# EAGLE design v8_engine (EAGLE 8.3.2)
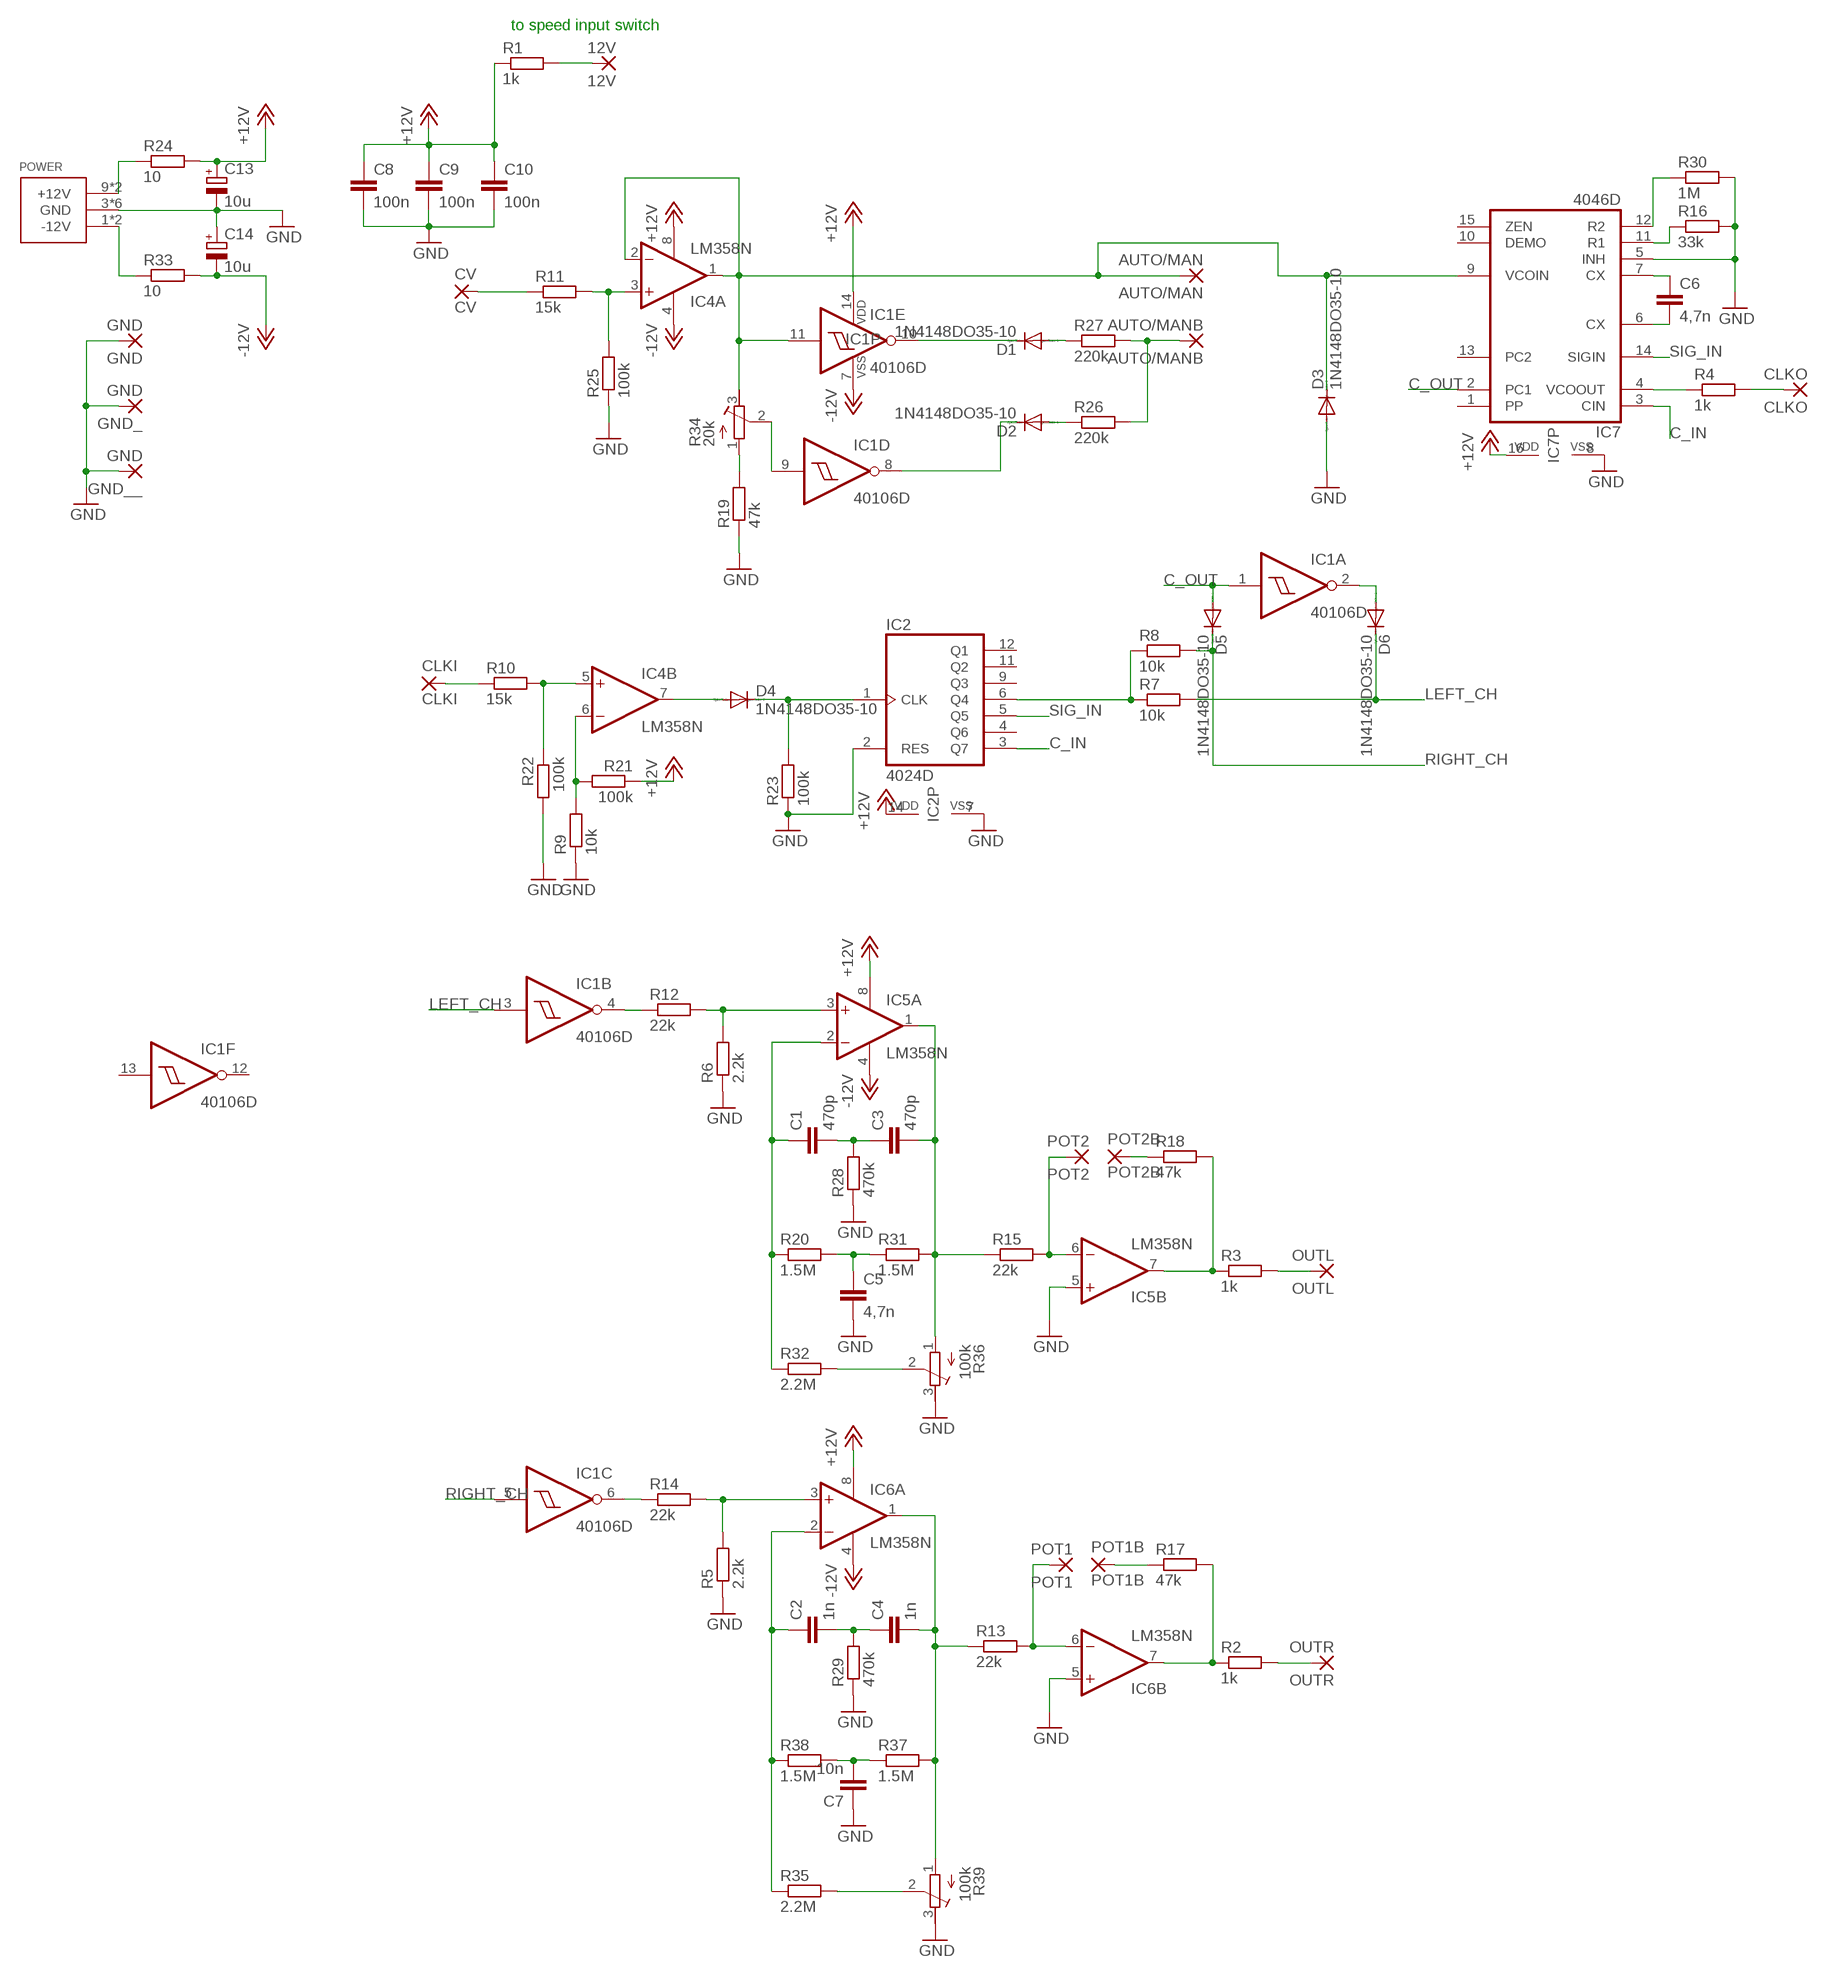
[diagram p0: schematic, sheet 1]

## Parts
12V  12V  1,6/0,9  [1,6/0,9]
AUTO/MAN  AUTO/MAN  1,6/0,9  [1,6/0,9]
AUTO/MANB  AUTO/MANB  1,6/0,9  [1,6/0,9]
C1  470p  C-EU050-025X075  [C050-025X075]
C2  1n  C-EU050-025X075  [C050-025X075]
C3  470p  C-EU050-025X075  [C050-025X075]
C4  1n  C-EU050-025X075  [C050-025X075]
C5  4,7n  C-EU050-025X075  [C050-025X075]
C6  4,7n  C-EU050-025X075  [C050-025X075]
C7  10n  C-EU050-025X075  [C050-025X075]
C8  100n  C-EU050-025X075  [C050-025X075]
C9  100n  C-EU050-025X075  [C050-025X075]
C10  100n  C-EU050-025X075  [C050-025X075]
C13  10u  CPOL-EUE2.5-6  [E2,5-6]
C14  10u  CPOL-EUE2.5-6  [E2,5-6]
CLKI  CLKI  1,6/0,9  [1,6/0,9]
CLKO  CLKO  1,6/0,9  [1,6/0,9]
CV  CV  1,6/0,9  [1,6/0,9]
D1  1N4148DO35-10  [DO35-10]
D2  1N4148DO35-10  [DO35-10]
D3  1N4148DO35-10  [DO35-10]
D4  1N4148DO35-10  [DO35-10]
D5  1N4148DO35-10  [DO35-10]
D6  1N4148DO35-10  [DO35-10]
GND  GND  1,6/0,9  [1,6/0,9]
GND_  GND  1,6/0,9  [1,6/0,9]
GND__  GND  1,6/0,9  [1,6/0,9]
IC1  40106D  [SO14]
IC2  4024D  [SO14]
IC4  LM358N  [DIL08]
IC5  LM358N  [DIL08]
IC6  LM358N  [DIL08]
IC7  4046D  [SO16]
OUTL  OUTL  1,6/0,9  [1,6/0,9]
OUTR  OUTR  1,6/0,9  [1,6/0,9]
POT1  POT1  1,6/0,9  [1,6/0,9]
POT1B  POT1B  1,6/0,9  [1,6/0,9]
POT2  POT2  1,6/0,9  [1,6/0,9]
POT2B  POT2B  1,6/0,9  [1,6/0,9]
POWER  POWER_SIMPLE10  [POWER_10]
R1  1k  R-EU_0207/10  [0207/10]
R2  1k  R-EU_0207/10  [0207/10]
R3  1k  R-EU_0207/10  [0207/10]
R4  1k  R-EU_0207/10  [0207/10]
R5  2.2k  R-EU_0207/10  [0207/10]
R6  2.2k  R-EU_0207/10  [0207/10]
R7  10k  R-EU_0207/10  [0207/10]
R8  10k  R-EU_0207/10  [0207/10]
R9  10k  R-EU_0207/10  [0207/10]
R10  15k  R-EU_0207/10  [0207/10]
R11  15k  R-EU_0207/10  [0207/10]
R12  22k  R-EU_0207/10  [0207/10]
R13  22k  R-EU_0207/10  [0207/10]
R14  22k  R-EU_0207/10  [0207/10]
R15  22k  R-EU_0207/10  [0207/10]
R16  33k  R-EU_0207/10  [0207/10]
R17  47k  R-EU_0207/10  [0207/10]
R18  47k  R-EU_0207/10  [0207/10]
R19  47k  R-EU_0207/10  [0207/10]
R20  1.5M  R-EU_0207/10  [0207/10]
R21  100k  R-EU_0207/10  [0207/10]
R22  100k  R-EU_0207/10  [0207/10]
R23  100k  R-EU_0207/10  [0207/10]
R24  10  R-EU_0207/10  [0207/10]
R25  100k  R-EU_0207/10  [0207/10]
R26  220k  R-EU_0207/10  [0207/10]
R27  220k  R-EU_0207/10  [0207/10]
R28  470k  R-EU_0207/10  [0207/10]
R29  470k  R-EU_0207/10  [0207/10]
R30  1M  R-EU_0207/10  [0207/10]
R31  1.5M  R-EU_0207/10  [0207/10]
R32  2.2M  R-EU_0207/10  [0207/10]
R33  10  R-EU_0207/10  [0207/10]
R34  20k  R-TRIMM3339P  [RTRIM3339P]
R35  2.2M  R-EU_0207/10  [0207/10]
R36  100k  R-TRIMM3339P  [RTRIM3339P]
R37  1.5M  R-EU_0207/10  [0207/10]
R38  1.5M  R-EU_0207/10  [0207/10]
R39  100k  R-TRIMM3339P  [RTRIM3339P]

## Nets
+12V: C8.1 C9.1 C10.1 C13.+ IC1.14(P:VDD) IC2.14(VDD) IC4.8(P:V+) IC5.8(P:V+) IC6.8(P:V+) IC7.16(VDD) R1.1 R21.1 R24.2
-12V: C14.- IC1.7(P:VSS) IC4.4(P:V-) IC5.4(P:V-) IC6.4(P:V-) R33.2
C_IN: IC2.3(Q7) IC7.3(CIN)
C_OUT: D5.A IC1.1(A:I) IC7.2(PC1)
CLKO: CLKO.1(P) R4.2
GND: C5.2 C7.1 C8.2 C9.2 C10.2 C13.- C14.+ D3.A GND.1(P) GND_.1(P) GND__.1(P) IC2.2(RES) IC2.7(VSS) IC5.5(B:+IN) IC6.5(B:+IN) IC7.5(INH) IC7.8(VSS) POWER.3(GND) POWER.4(GND) POWER.5(GND) POWER.6(GND) POWER.7(GND) POWER.8(GND) R5.1 R6.1 R9.1 R16.2 R19.1 R22.2 R23.1 R25.1 R28.1 R29.1 R30.2 R36.3(E) R39.3(E)
LEFT_CH: D6.C IC1.3(B:I) R7.2
N$1: IC7.4(VCOOUT) R4.1
N$2: D1.A R27.1
N$3: POWER.9(+12V) POWER.10(+12V) R24.1
N$4: POWER.1(-12V) POWER.2(-12V) R33.1
N$5: AUTO/MANB.1(P) R26.2 R27.2
N$6: D2.C IC1.8(D:O)
N$7: D2.A R26.1
N$8: D1.C IC1.10(E:O)
N$10: IC1.9(D:I) R34.2(S)
N$11: CLKI.1(P) R10.1
N$12: R19.2 R34.1(A)
N$13: CV.1(P) R11.1
N$14: IC4.3(A:+IN) R11.2 R25.2
N$15: IC4.5(B:+IN) R10.2 R22.1
N$16: C6.1 IC7.7(CX)
N$17: C6.2 IC7.6(CX)
N$18: IC7.11(R1) R16.1
N$19: IC7.12(R2) R30.1
N$20: D4.A IC4.7(B:OUT)
N$21: D4.C IC2.1(CLK) R23.2
N$22: IC2.6(Q4) R7.1 R8.1
N$23: IC4.6(B:-IN) R9.2 R21.2
N$24: IC1.4(B:O) R12.1
N$25: IC5.3(A:+IN) R6.2 R12.2
N$26: D6.A IC1.2(A:O)
N$27: C1.1 IC5.2(A:-IN) R20.1 R32.1
N$28: R32.2 R36.2(S)
N$29: C3.2 IC5.1(A:OUT) R15.1 R31.2 R36.1(A)
N$30: C5.1 R20.2 R31.1
N$31: C1.2 C3.1 R28.2
N$32: IC5.6(B:-IN) POT2.1(P) R15.2
N$33: IC5.7(B:OUT) R3.1 R18.2
N$34: POT2B.1(P) R18.1
N$35: OUTL.1(P) R3.2
N$36: C2.2 C4.1 R29.2
N$37: C2.1 IC6.2(A:-IN) R35.1 R38.1
N$38: C4.2 IC6.1(A:OUT) R13.1 R37.2 R39.1(A)
N$39: C7.2 R37.1 R38.2
N$40: 12V.1(P) R1.2
N$41: IC1.6(C:O) R14.1
N$42: IC6.3(A:+IN) R5.2 R14.2
N$43: IC6.6(B:-IN) POT1.1(P) R13.2
N$44: OUTR.1(P) R2.2
N$45: POT1B.1(P) R17.1
N$46: IC6.7(B:OUT) R2.1 R17.2
N$47: R35.2 R39.2(S)
N$48: AUTO/MAN.1(P) D3.C IC1.11(E:I) IC4.1(A:OUT) IC4.2(A:-IN) IC7.9(VCOIN) R34.3(E)
RIGHT_CH: D5.C IC1.5(C:I) R8.2
SIG_IN: IC2.5(Q5) IC7.14(SIGIN)
Unconnected: IC1.12(F:O) IC1.13(F:I) IC2.4(Q6) IC2.9(Q3) IC2.11(Q2) IC2.12(Q1) IC7.1(PP) IC7.10(DEMO) IC7.13(PC2) IC7.15(ZEN)

## Notes on the sheet
- to speed input switch

## Library data of the parts
12V AUTO/MAN AUTO/MANB CLKI CLKO CV GND GND_ GND__ OUTL OUTR POT1 POT1B POT2 POT2B = wirepad:1,6/0,9: THROUGH-HOLE PAD
C1-C10 = rcl:C-EU: CAPACITOR, European symbol
C13 C14 = rcl:CPOL-EU: POLARIZED CAPACITOR, European symbol
D1-D6 = diode:1N4148: DIODE high speed (Philips)
IC1 = 40xx:40106: Hex SCHMITT TRIGGER
IC2 = 40xx:4024: 7-stage binary/ripple COUNTER
IC4-IC6 = linear:LM358: OP AMP also LM158; LM258; LM2904 Source: http://cache.national.com/ds/LM/LM158.pdf
IC7 = 40xx:4046: Micropower PLL
POWER = eurorack:POWER_SIMPLE
R1-R33 R35 R37 R38 = resistor:R-EU_: RESISTOR, European symbol
R34 R36 R39 = rcl:R-TRIMM: Trimm resistor

## Board
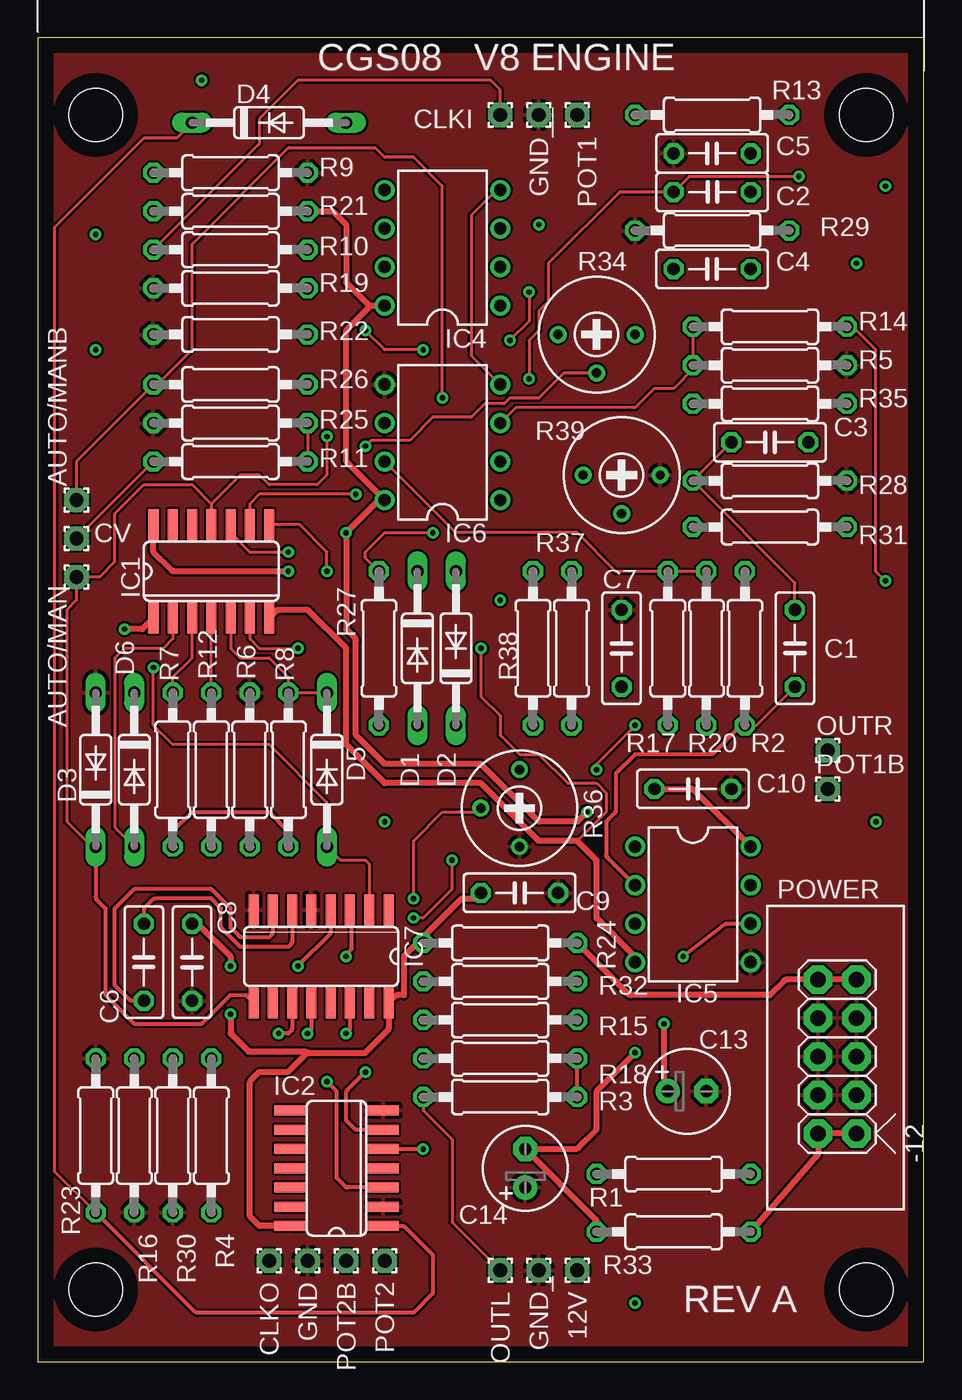
[diagram p1: board, top side]
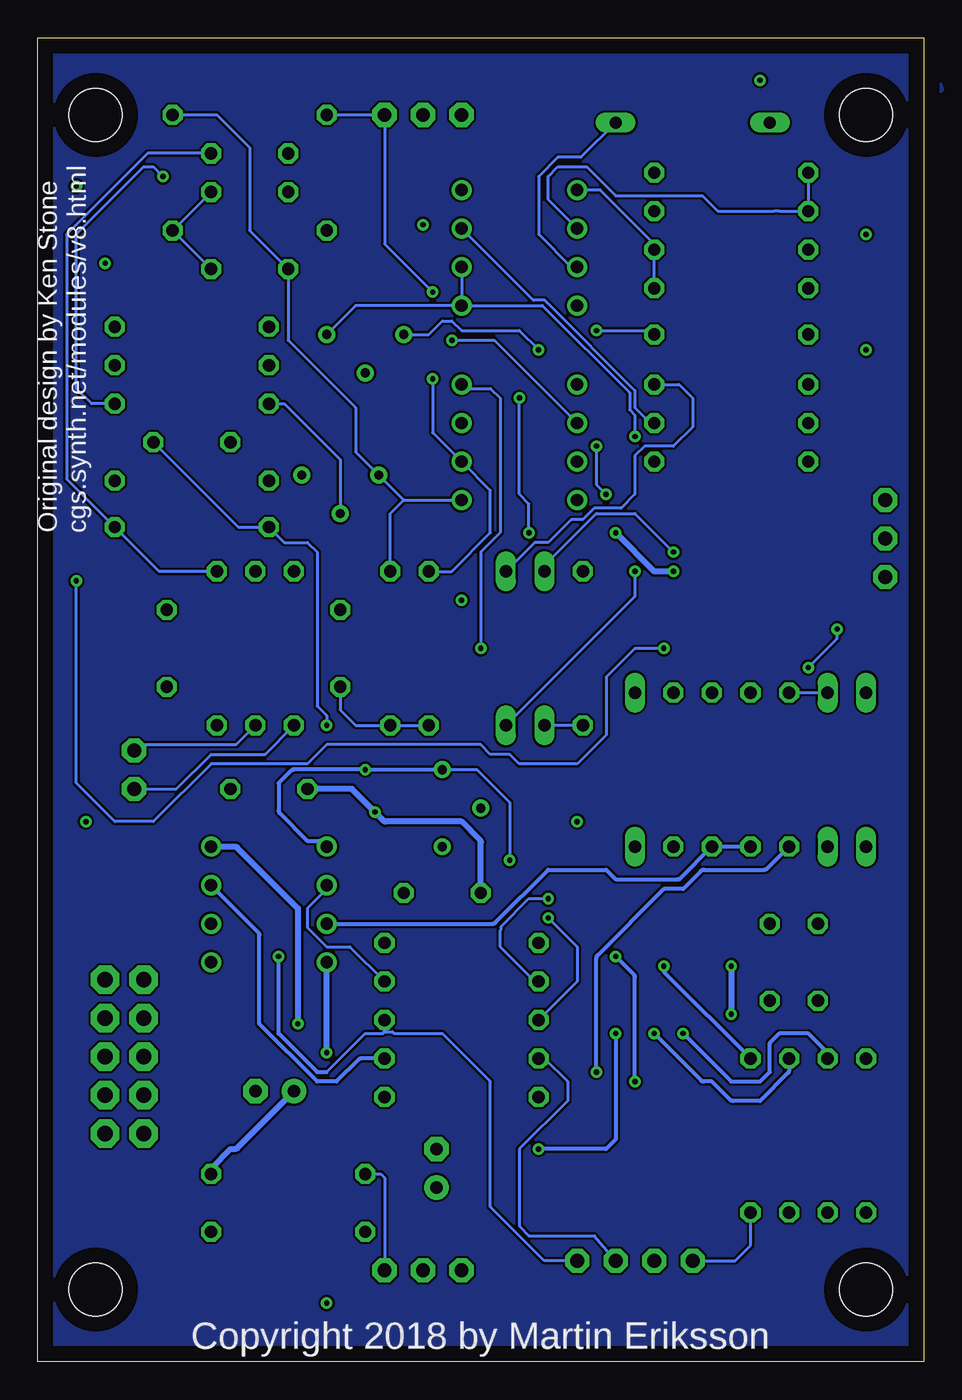
[diagram p2: board, bottom side, seen from below]

Size 58.41 x 87.3 mm. Coordinates in mm from the lower left corner, seen from the top.
Outline: 0,87.3 0,0 58.41,0 58.41,87.3 0,87.3
Copper layers (1*16): Top 0.035mm / dielectric 1.5mm / Bottom 0.035mm
Design rules "default": minimum track width 6mil, minimum drill 0.35mm, track to track 6mil, track to pad 6mil, pad to pad 6mil, via to via 6mil, smd to smd 6mil, copper to edge 40mil, drill to drill 6mil, minimum pad ring 10mil, minimum via ring 8mil, stop-mask expansion 4mil, vias tented up to drill 0mil, thermal gap 10mil
Holes 3.5 mm at 54.61,82.22 54.61,4.75 3.81,82.22 3.81,4.75

### Footprints (pad centres in the part's own frame; a part is rotated, then mirrored left to right if it is on the bottom)
1,6/0,9 = drill 0.914 pad 1.6 octagon: 1 0,0
C050-025X075 = drill 0.813 octagon: 1 -2.54,0; 2 2.54,0
E2,5-6 = drill 0.813 pad 1.6: + -1.27,0 | drill 0.813 pad 1.6 octagon: - 1.27,0
DO35-10 = drill 0.813 long: A 5.08,0; C -5.08,0
SO14 = smd 0.66 x 2.032: 1 -3.81,-3.073; 2 -2.54,-3.073; 3 -1.27,-3.073; 4 0,-3.073; 5 1.27,-3.073; 6 2.54,-3.073; 7 3.81,-3.073; 8 3.81,3.073; 9 2.54,3.073; 10 1.27,3.073; 11 0,3.073; 12 -1.27,3.073; 13 -2.54,3.073; 14 -3.81,3.073
DIL08 = drill 0.813 pad 1.27: 1 -3.81,-3.81; 2 -1.27,-3.81; 3 1.27,-3.81; 4 3.81,-3.81; 5 3.81,3.81; 6 1.27,3.81; 7 -1.27,3.81; 8 -3.81,3.81
SO16 = smd 0.66 x 2.032: 1 -4.445,-3.073; 2 -3.175,-3.073; 3 -1.905,-3.073; 4 -0.635,-3.073; 5 0.635,-3.073; 6 1.905,-3.073; 7 3.175,-3.073; 8 4.445,-3.073; 9 4.445,3.073; 10 3.175,3.073; 11 1.905,3.073; 12 0.635,3.073; 13 -0.635,3.073; 14 -1.905,3.073; 15 -3.175,3.073; 16 -4.445,3.073
POWER_10 = drill 1.016 pad 1.88 octagon: 1 -5.08,-1.27; 2 -5.08,1.27; 3 -2.54,-1.27; 4 -2.54,1.27; 5 0,-1.27; 6 0,1.27; 7 2.54,-1.27; 8 2.54,1.27; 9 5.08,-1.27; 10 5.08,1.27
0207/10 = drill 0.813 octagon: 1 -5.08,0; 2 5.08,0
RTRIM3339P = drill 0.61: 1 -2.54,0; 2 0,-2.54; 3 2.54,0

### Placement (x,y rotation side)
12V  35.56,6.02 0 top
AUTO/MAN  2.54,51.74 0 top
AUTO/MANB  2.54,56.82 0 top
C1  49.91,47.04 90 top
C2  44.45,77.14 0 top
C3  48.26,60.63 0 top
C4  44.45,72.06 180 top
C5  44.45,79.68 180 top
C6  6.99,26.34 90 top
C7  38.48,47.04 270 top
C8  10.16,26.34 270 top
C9  31.75,30.91 0 top
C10  43.18,37.77 0 top
C13  42.8,17.83 0 top
C14  32.13,12.75 90 top
CLKI  30.48,82.22 0 top
CLKO  15.24,6.66 0 top
CV  2.54,54.28 0 top
D1  25.02,47.04 270 top
D2  27.56,47.04 90 top
D3  3.81,39.04 90 top
D4  15.24,81.71 0 top
D5  19.05,39.04 270 top
D6  6.35,39.04 270 top
GND  17.78,6.66 0 top
GND_  33.02,6.02 0 top
GND__  33.02,82.22 0 top
IC1  11.43,52.12 0 top
IC2  19.68,12.75 90 top
IC4  26.67,73.46 90 top
IC5  43.18,30.15 270 top
IC6  26.67,60.63 90 top
IC7  18.67,26.72 180 top
OUTL  30.48,6.02 0 top
OUTR  52.07,40.31 0 top
POT1  35.56,82.22 0 top
POT1B  52.07,37.77 0 top
POT2  22.86,6.66 0 top
POT2B  20.32,6.66 0 top
POWER  52.7,20.12 90 top
R1  41.91,12.37 180 top
R2  44.07,47.04 270 top
R3  30.48,17.45 180 top
R4  11.43,14.91 270 top
R5  48.26,65.71 180 top
R6  13.97,39.04 270 top
R7  8.89,39.04 90 top
R8  16.51,39.04 90 top
R9  12.7,78.41 180 top
R10  12.7,73.33 0 top
R11  12.7,59.36 0 top
R12  11.43,39.04 270 top
R13  44.45,82.22 180 top
R14  48.26,68.25 180 top
R15  30.48,22.53 0 top
R16  6.35,14.91 270 top
R17  41.53,47.04 90 top
R18  30.48,19.99 0 top
R19  12.7,67.74 0 top
R20  46.61,47.04 90 top
R21  12.7,75.87 180 top
R22  12.7,70.79 180 top
R23  3.81,14.91 270 top
R24  30.48,27.61 180 top
R25  12.7,61.9 0 top
R26  12.7,64.44 180 top
R27  22.48,47.04 90 top
R28  48.26,58.09 180 top
R29  44.45,74.6 0 top
R30  8.89,14.91 270 top
R31  48.26,55.04 180 top
R32  30.48,25.07 180 top
R33  41.91,8.56 180 top
R34  36.83,67.74 0 top
R35  48.26,63.17 180 top
R36  31.75,36.5 270 top
R37  35.18,47.04 90 top
R38  32.64,47.04 270 top
R39  38.48,58.47 0 top

### Tracks (layer width: path | path; a pad name or v marks a point on that pad's centre or on a via)
+12V  (via drill 0.35)
  Top 0.406: 17.71,20.3 arc-45 17.89,20.37 | C8.1 10.44,28.88 arc-45 10.62,28.81 12.7,26.72 v12.7,26.09 | C9.1 28.9,30.6 arc-45 28.72,30.53 27.94,30.53 25.47,28.06 arc45 25.4,27.89 R24.2 25.12,27.61 arc45 24.95,27.54 24.13,26.72 24.13,24.18 23.75,24.18 arc45 23.57,24.11 IC7.16 23.11,22 arc-45 23.04,21.82 21.59,20.37 17.78,20.37 | v36.2,36.25 35.56,35.61 33.02,35.61 29.21,39.42 22.86,39.42 20.95,41.33 20.95,47.57 arc45 20.88,47.75 20.32,48.31 v20.32,54.66 22.41,56.75 arc-45 22.58,56.82 IC6.8 20.39,59.29 arc-45 20.32,59.47 20.32,67.91 arc-45 20.39,68.09 21.95,69.65 | v16.51,52.12 8.99,52.12 arc-45 8.82,52.2 7.62,53.39 IC1.14 | 21.95,69.65 IC4.8 | 21.95,69.65 arc-45 21.77,69.72 20.32,71.17 20.32,74.98 19.5,75.8 arc45 19.33,75.87 R21.1 | C10.1 43.08,37.77 arc-45 43.25,37.7 IC5.8 | 17.78,20.37 arc45 17.6,20.44 13.9,20.44 12.7,21.64 v12.7,22.91 | 17.71,20.3 17.78,20.37 | v41.27,22.28 41.27,18.19 arc45 41.35,18.01 C13.+ | IC2.14 14.71,8.94 arc-45 14.53,9.02 13.97,9.58 13.97,18.36 arc-45 14.04,18.54 14.61,19.1 16.41,19.1 arc45 16.58,19.17 17.71,20.3
  Bottom 0.406: C9.1 29.21,34.24 arc-45 29.28,34.41 30.48,35.61 35.45,35.61 arc45 35.63,35.69 v36.2,36.25 37.72,37.77 C10.1 | IC5.8 45.44,33.96 arc45 45.27,33.89 41.27,29.9 v41.27,22.28 | 41.91,18.32 arc-45 41.84,18.14 C13.+ 45.27,14.1 arc45 45.44,14.02 45.72,14.02 46.92,12.82 arc-45 46.99,12.65 R1.1 | v12.7,26.09 v12.7,22.91 | v16.51,52.12 17.78,52.12 v20.32,54.66
-12V  (via drill 0.35)
  Top 0.2: IC4.4 30.23,77.27 28.57,75.62 28.57,66.34 IC6.4 | v29.21,47.04 29.21,43.87 30.48,42.6 30.48,41.33 31.75,40.06 33.02,40.06 34.92,38.15 36.83,38.15 37.47,37.52 37.47,36.25 35.56,34.34
  Top 0.406: R33.2 36.83,9.22 arc45 36.76,9.4 C14.- 35.45,14.02 arc45 35.63,14.1 36.83,15.29 36.83,17.73 arc-45 36.9,17.9 v39.37,20.37 | IC5.4 39.37,26.62 arc45 39.3,26.79 36.83,29.26 36.83,32.97 arc45 36.76,33.15 35.56,34.34 33.12,34.34 arc-45 32.95,34.41 29.21,38.15 22.86,38.15 20.32,40.69 20.32,46.94 arc45 20.25,47.12 17.78,49.58 15.88,49.58 arc45 15.7,49.51 IC1.7
  Bottom 0.2: IC6.4 30.23,64.19 28.57,64.19 27.94,63.55 27.94,54.66 29.21,53.39 v29.21,47.04
  Bottom 0.406: v39.37,20.37 IC5.4
C_IN  (via drill 0.35)
  Top 0.254: IC2.3 20.43,11.48 arc-45 20.25,11.55 19.68,12.12 19.68,17.83 v19.05,18.47 | v20.32,26.72 20.32,26.74 arc-45 20.39,26.92 20.7,27.23 20.7,29.56 arc45 20.63,29.74 IC7.3
  Bottom 0.254: v19.05,18.47 19.05,25.35 arc-45 19.12,25.52 v20.32,26.72
C_OUT  (via drill 0.35)
  Top 0.2: IC7.2 21.84,32.82 21.59,33.07 19.94,33.07 D5.A 19.05,36.88 15.24,40.69 8.89,40.69 7.62,41.96 v7.62,45.77
  Top 0.406: IC1.1 6.88,48.31 v5.71,48.31
  Bottom 0.2: v7.62,45.77 5.71,47.68 v5.71,48.31
CLKO
  Bottom 0.2: R4.2 11.43,7.67 12.45,6.66 CLKO.1
GND
  pour Top: 0,87.68 0,0.05 58.42,0.05 58.42,87.68
LEFT_CH
  Top 0.2: R7.2 8.89,45.14 10.16,46.41 IC1.3
  Bottom 0.2: R7.2 D6.C
N$1  (via drill 0.35)
  Top 0.254: IC7.4 19.3,28.35 arc-45 19.23,28.17 v17.14,26.09
  Bottom 0.254: v17.14,26.09 17.14,25.81 arc-45 17.07,25.63 R4.1
N$2
  Bottom 0.2: R27.1 D1.A
N$3
  Top 0.406: POWER.9 POWER.10 49.38,25.2 arc45 49.2,25.12 48.26,24.18 39.09,24.18 arc-45 38.91,24.25 R24.1
N$4
  Top 0.406: POWER.1 POWER.2 51.44,13.75 arc-45 51.36,13.57 R33.1
N$5  (via drill 0.35)
  Top 0.2: AUTO/MANB.1 2.54,59.36 R26.2 7.87,64.44 10.16,66.73 10.16,73.71 16.51,80.06 22.23,80.06 22.86,79.43 24.77,79.43 26.67,77.52 v26.67,63.55 | R27.2 21.59,53.01 21.59,53.39 22.86,54.66 v26.04,54.66
  Bottom 0.2: v26.67,63.55 26.67,57.2 26.04,56.57 v26.04,54.66
N$6  (via drill 0.35)
  Top 0.2: IC1.8 15.88,55.19 15.98,55.19 17.25,55.19 19.05,53.39 v19.05,52.12
  Bottom 0.2: v19.05,52.12 19.05,50.47 D2.C
N$7
  Bottom 0.2: R26.1 16.13,64.44 15.24,63.55 15.24,61.65 16.51,60.38 18.41,60.38 19.05,59.74 19.05,57.2 19.97,56.28 21.74,56.28 22.47,55.55 23.25,55.55 24.77,54.03 25.65,54.03 D2.A
N$8  (via drill 0.35)
  Top 0.2: IC1.10 12.7,54.66 13.97,53.39 v16.51,53.39
  Bottom 0.2: D1.C 25.02,52.5 21.59,55.93 19.05,55.93 v16.51,53.39
N$9
  pour Bottom: 0,87.05 58.42,87.05 58.42,0.69 57.78,0.05 -0.64,0.05 -0.64,83.24 -1.27,83.87
N$10  (via drill 0.35)
  Top 0.2: R34.2 34.67,65.2 33.02,63.55 31.11,63.55 30.73,63.17 29.46,63.17 28.57,62.28 26.04,62.28 24.51,60.76 21.97,60.76 v21.59,60.38 | v20.95,57.2 14.61,57.2 13.97,56.57 IC1.9
  Bottom 0.2: v20.95,57.2 21.59,57.84 v21.59,60.38
N$11
  Top 0.2: CLKI.1 30.48,83.87 29.84,84.51 17.14,84.51 14.61,81.97 14.61,80.31 R10.1
N$12  (via drill 0.35)
  Top 0.2: v25.4,66.73 22.86,66.73 v21.59,68
  Bottom 0.2: R34.1 32.64,67.74 31.75,68.63 31.11,68.63 30.48,68 26.67,68 v25.4,66.73 | v21.59,68 18.03,68 R19.2
N$13
  Top 0.2: R11.1 CV.1
N$14
  Top 0.2: R25.2 R11.2
  Bottom 0.2: 25,70 24.83,69.83 | 24.83,69.83 19.05,64.05 19.05,62.92 18.03,61.9 R25.2 | 24.83,69.83 25,70 | 25,70 25.75,70 IC4.3
N$15
  Bottom 0.2: R22.1 R10.2 17.78,73.71 21.34,77.27 IC4.5
N$16
  Top 0.254: IC7.7 15.49,28.35 arc-45 15.42,28.17 15.24,27.99 13.44,27.99 arc-45 13.26,28.06 12.7,28.63 12.7,29.9 11.43,31.17 6.35,31.17 5.08,29.9 5.08,24.82 6.02,23.87 arc45 6.2,23.8 C6.1
N$17
  Top 0.254: IC7.6 16.76,27.71 arc-45 16.69,27.54 16.51,27.36 13.34,27.36 12.06,28.63 12.06,29.9 11.43,30.53 7.72,30.53 arc45 7.55,30.46 6.99,29.9 C6.2
N$18  (via drill 0.35)
  Top 0.254: IC7.11 16.76,22 arc-45 16.69,21.82 16.51,21.64 v15.88,21.64
  Bottom 0.254: v15.88,21.64 12.7,18.47 10.79,18.47 10.16,19.1 10.16,21.01 9.53,21.64 7.62,21.64 6.42,20.44 arc45 6.35,20.27 R16.1
N$19  (via drill 0.35)
  Top 0.254: IC7.12 18.03,22 arc-45 17.96,21.82 v17.78,21.64
  Bottom 0.254: R30.1 8.89,19.21 arc45 8.96,19.03 10.79,17.2 12.6,17.2 arc45 12.77,17.27 13.97,18.47 14.5,18.47 arc45 14.68,18.54 v17.78,21.64
N$20
  Bottom 0.2: D4.A 22.61,79.43 24.13,79.43 25.4,78.16 25.4,74.35 23.24,72.19 IC4.7
N$21
  Top 0.2: D4.C 9.14,80.7 8.26,80.7 6.99,80.7 1.91,75.62 1.12,74.83 1.12,12.52 R23.2
  Top 0.254: IC2.1 24.02,8.94 arc-45 24.2,8.87 26.04,7.04 26.04,4.5 24.77,3.23 10.52,3.23 arc-45 10.34,3.3 R23.2
N$22  (via drill 0.35)
  Top 0.254: R7.1 8.89,34.87 arc-45 8.96,35.05 10.16,36.25 15.24,36.25 16.51,34.98 R8.1 | IC2.6 20.95,15.29 20.32,15.93 20.32,17.73 arc-45 20.39,17.9 v21.59,19.1
  Bottom 0.254: v21.59,19.1 21.59,26.62 arc45 21.52,26.79 17.14,31.17 15.88,31.17 14.68,32.36 arc45 14.5,32.44 10.52,32.44 arc-45 10.34,32.51 R7.1
N$23
  Bottom 0.2: R9.2 R21.2 9.53,75.87 9.91,75.87 13.59,75.87 14.61,76.89 20.32,76.89 22.23,78.79 24.13,78.79 24.77,78.16 24.77,76.63 IC4.6
N$24
  Top 0.2: R12.1 IC1.4
N$25
  Bottom 0.254: IC5.3 28.43,28.88 arc-45 28.25,28.95 24.77,32.44 20.95,32.44 20.32,31.8 16.23,31.8 arc-45 16.05,31.88 R6.2 R12.2
N$26
  Top 0.2: IC1.2 8.89,47.68 8.26,47.04 5.71,47.04 5.08,46.41 5.08,35.23 D6.A
N$27
  Top 0.2: R20.1 47.37,41.96 C1.1
  Top 0.254: R20.1 46.46,41.96 arc45 46.28,41.89 44.45,40.06 39.37,40.06 38.1,38.79 38.1,36.35 arc-45 38.03,36.17 37.47,35.61 37.47,33.43 arc45 37.54,33.25 IC5.2
  Bottom 0.2: IC5.2 39.37,31.17 40.64,29.9 40.64,28.63 39.37,27.36 37.85,27.36 R32.1
N$28  (via drill 0.35)
  Top 0.2: R36.2 28.96,36.25 26.67,36.25 24.77,34.34 v24.77,30.53
  Bottom 0.2: R32.2 25.65,25.07 27.94,27.36 27.94,28.43 27.87,28.5 27.87,28.7 26.04,30.53 v24.77,30.53
N$29  (via drill 0.35)
  Top 0.2: v39.37,41.96 36.83,39.42 v36.83,39.04 | v27.3,33.07 27.3,31.17 25.4,29.26 v24.77,29.26
  Bottom 0.2: C3.2 45.21,55.04 R31.2 42.16,54.03 40.64,54.03 40.01,53.39 40.01,43.23 39.37,42.6 v39.37,41.96 | R36.1 29.46,39.04 27.3,36.88 v27.3,33.07 | v24.77,29.26 22.86,27.36 22.86,25.07 R15.1
  Bottom 0.254: R36.1 v36.83,39.04 41.55,39.04 arc-45 41.73,38.97 42.55,38.15 42.55,36.35 arc-45 42.47,36.17 40.64,34.34 39.86,34.34 arc45 39.68,34.27 IC5.1
N$30
  Bottom 0.2: R20.2 50.42,52.12 R31.1 56.52,58.22 56.52,74.35 51.18,79.68 C5.1
N$31
  Top 0.2: C1.2 49.91,51.36 R28.2 C3.1
N$32  (via drill 0.35)
  Top 0.254: IC5.6 45.44,28.88 arc45 45.27,28.81 v42.55,26.72
  Bottom 0.2: POT2.1 25.02,6.66 28.57,10.21 28.57,18.47 31.75,21.64 34.92,21.64 35.03,21.75 35.56,21.75 35.66,21.64 36.83,21.64 39.37,19.1
  Bottom 0.254: R15.2 35.56,21.75 | 39.37,19.1 40.01,19.1 42.55,21.64 v42.55,26.72
N$33
  Top 0.254: R3.1 R18.2
  Bottom 0.254: R18.2 37.11,19.99 arc-45 37.28,19.92 38.73,18.47 40.01,18.47 43.81,22.28 43.81,28.14 arc-45 43.89,28.32 IC5.7
N$34
  Bottom 0.2: R18.1 25.02,19.99 23.5,18.47 23.5,17.2 26.67,14.02 26.67,8.94 26.04,8.31 21.72,8.31 POT2B.1
N$35
  Top 0.2: R3.2 25.4,16.56 27.3,14.66 27.3,9.2 OUTL.1
N$36
  Bottom 0.2: C2.2 R29.2 C4.1
N$37  (via drill 0.35)
  Top 0.2: v50.16,78.16 42.93,78.16 C2.1 38.35,77.14 33.66,72.44 33.66,69.9 33.02,69.27 33.02,68 32.38,67.36 v32.38,64.82
  Bottom 0.2: R38.1 31.11,52.12 28.57,54.66 28.57,57.46 IC6.2 32.38,61.27 v32.38,64.82 | R35.1 54.86,63.17 55.88,64.19 55.88,74.35 51.44,78.79 50.8,78.79 v50.16,78.16
N$38
  Bottom 0.2: R13.1 46.61,82.22 44.45,80.06 44.45,74.6 C4.2 41.91,67.36 37.47,62.92 37.47,60 R39.1 34.29,56.82 | 34.29,56.82 IC6.1 | R37.2 35.18,55.93 34.29,56.82
N$39
  Bottom 0.2: R38.2 R37.1 37.47,41.96 38.48,42.98 C7.2
N$40
  Bottom 0.2: R1.2 35.81,12.37 35.56,12.12 12V.1
N$41  (via drill 0.35)
  Top 0.2: IC1.6 13.97,47.68 14.61,47.04 v17.14,47.04 | v55.88,51.49 55.24,52.12 55.24,66.73 53.72,68.25 R14.1
  Bottom 0.2: v17.14,47.04 19.05,47.04 20.95,45.14 20.95,41.33 22.86,39.42 26.67,39.42 27.3,40.06 28.57,40.06 29.21,40.69 39.37,40.69 40.64,39.42 46.99,39.42 50.8,35.61 53.34,35.61 55.88,38.15 v55.88,51.49
N$42
  Top 0.2: R14.2 R5.2 43.18,65.46 41.91,64.19 40.64,64.19 39.37,62.92 31.5,62.92 IC6.3
N$43  (via drill 0.35)
  Top 0.2: v32.38,70.54 32.38,68.63 v31.11,67.36
  Bottom 0.2: R13.2 POT1.1 35.56,73.71 v32.38,70.54 | v31.11,67.36 28.32,67.36 IC6.6
N$44
  Bottom 0.2: OUTR.1 51.82,40.31 51.44,40.69 45.34,40.69 R2.2
N$45
  Bottom 0.2: POT1B.1 49.28,37.77 46.99,40.06 43.43,40.06 R17.1
N$46
  Top 0.2: R2.1 R17.2 38.1,52.12 35.56,54.66 27.56,54.66 IC6.7
N$47
  Bottom 0.2: R35.2 42.16,63.17 38.48,59.49 R39.2
N$48  (via drill 0.35)
  Top 0.2: 11.43,56.57 10.16,57.84 6.99,57.84 5.08,55.93 5.08,52.76 4.06,51.74 AUTO/MAN.1 2.54,50.22 1.91,49.58 1.91,35.61 3.81,33.71 | 11.43,56.57 IC1.11 | v19.05,61.01 19.05,58.47 18.41,57.84 15.24,57.84 14.61,58.47 13.34,58.47 11.43,56.57
  Top 0.254: D3.C 3.81,33.71 3.81,30.64 arc45 3.88,30.46 4.45,29.9 4.45,24.18 6.35,22.28 10.79,22.28 12.7,24.18 13.59,24.18 arc-45 13.77,24.11 IC7.9
  Bottom 0.2: IC4.1 25.15,69.65 19.4,63.9 19.4,62.77 19.05,62.42 v19.05,61.01 | IC4.1 37.47,69.65 R34.3 | IC4.2 IC4.1
N$49  (via drill 0.35)
  other vias: 3.81,74.35
N$50  (via drill 0.35)
  other vias: 3.81,66.73
N$51  (via drill 0.35)
  other vias: 22.86,35.61
N$52  (via drill 0.35)
  other vias: 39.37,3.86
N$53  (via drill 0.35)
  other vias: 55.24,35.61
N$54  (via drill 0.35)
  other vias: 55.88,77.52
N$55  (via drill 0.35)
  other vias: 53.98,72.44
N$56  (via drill 0.35)
  other vias: 33.02,74.98
N$57  (via drill 0.35)
  other vias: 10.79,84.51
N$58  (via drill 0.35)
  other vias: 30.48,50.22
RIGHT_CH
  Top 0.2: IC1.5 12.7,47.04 13.34,46.41 15.24,46.41 16.51,45.14 R8.2 D5.C
SIG_IN  (via drill 0.35)
  Top 0.2: v25.4,14.02 IC2.5
  Top 0.254: IC7.14 20.57,22 arc-45 20.5,21.82 v20.32,21.64 | 23.5,14.02 v25.4,14.02
  Bottom 0.254: v20.32,21.64 20.32,14.66 20.95,14.02 v25.4,14.02

### Text on the board
tNames: CGS08 V8 ENGINE | REV A
bNames: Original design by Ken Stone / cgs.synth.net/modules/v8.html | Copyright 2018 by Martin Eriksson